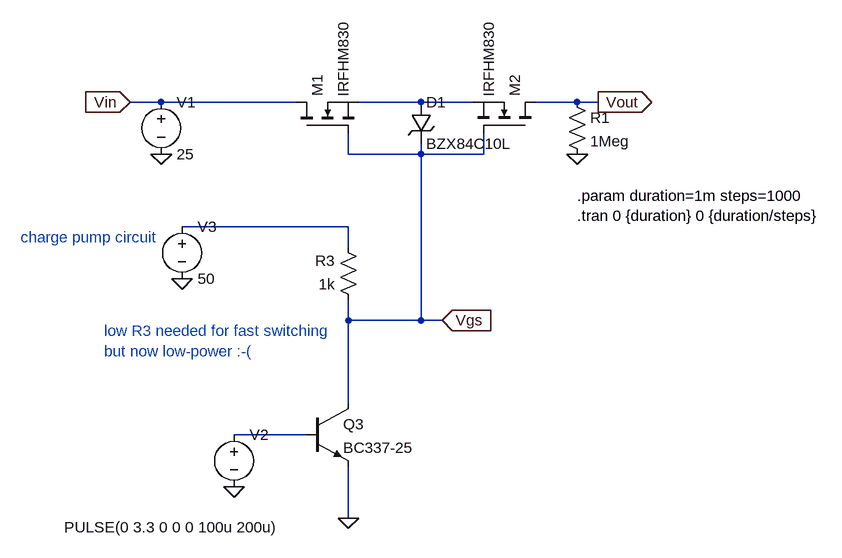
[diagram p0: schematic nmos-driver.asc]
nmos-driver.asc, the LTspice schematic file:
Version 4
SHEET 1 1196 828
WIRE 16 128 -32 128
WIRE 224 128 16 128
WIRE 416 128 320 128
WIRE 496 128 416 128
WIRE 656 128 592 128
WIRE 688 128 656 128
WIRE 304 208 304 176
WIRE 416 208 416 192
WIRE 416 208 304 208
WIRE 512 208 512 176
WIRE 512 208 416 208
WIRE 304 320 48 320
WIRE 304 352 304 320
WIRE 304 464 304 432
WIRE 416 464 416 208
WIRE 416 464 304 464
WIRE 448 464 416 464
WIRE 304 592 304 464
WIRE 240 640 128 640
WIRE 304 768 304 688
FLAG 16 208 0
FLAG 128 720 0
FLAG 688 128 Vout
IOPIN 688 128 Out
FLAG 304 768 0
FLAG 656 208 0
FLAG 448 464 Vgs
IOPIN 448 464 In
FLAG -32 128 Vin
IOPIN -32 128 In
FLAG 48 400 0
SYMBOL Voltage 16 112 R0
SYMATTR InstName V1
SYMATTR Value 25
SYMBOL Voltage 128 624 R0
WINDOW 3 -261 158 Left 2
SYMATTR Value PULSE(0 3.3 0 0 0 100u 200u)
SYMATTR InstName V2
SYMBOL npn 240 592 R0
SYMATTR InstName Q3
SYMATTR Value BC337-25
SYMBOL Res 640 112 R0
SYMATTR InstName R1
SYMATTR Value 1Meg
SYMBOL nmos 224 176 R270
SYMATTR InstName M1
SYMATTR Value IRFHM830
SYMBOL nmos 592 176 M270
SYMATTR InstName M2
SYMATTR Value IRFHM830
SYMBOL Res 320 448 R180
WINDOW 0 36 76 Left 2
WINDOW 3 36 40 Left 2
SYMATTR InstName R3
SYMATTR Value 1k
SYMBOL Voltage 48 304 R0
SYMATTR InstName V3
SYMATTR Value 50
SYMBOL zener 400 128 R0
SYMATTR InstName D1
SYMATTR Value BZX84C10L
TEXT 656 272 Left 2 !.param duration=1m steps=1000\n.tran 0 {duration} 0 {duration/steps}
TEXT -72 480 Left 2 ;low R3 needed for fast switching\nbut now low-power :-(
TEXT -200 336 Left 2 ;charge pump circuit

The netlist it stands for:
* nmos-driver.asc
V1 Vin 0 25
V2 N003 0 PULSE(0 3.3 0 0 0 100u 200u)
Q3 Vgs N003 0 0 BC337-25
R1 Vout 0 1Meg
M1 Vin Vgs N001 N001 IRFHM830
M2 Vout Vgs N001 N001 IRFHM830
R3 Vgs N002 1k
V3 N002 0 50
D1 N001 Vgs BZX84C10L
.model D D
.lib standard.dio
.model NPN NPN
.model PNP PNP
.lib standard.bjt
.model NMOS NMOS
.model PMOS PMOS
.lib standard.mos
.param duration=1m steps=1000
.tran 0 {duration} 0 {duration/steps}
* low R3 needed for fast switching
* but now low-power :-(
* charge pump circuit
.backanno
.end